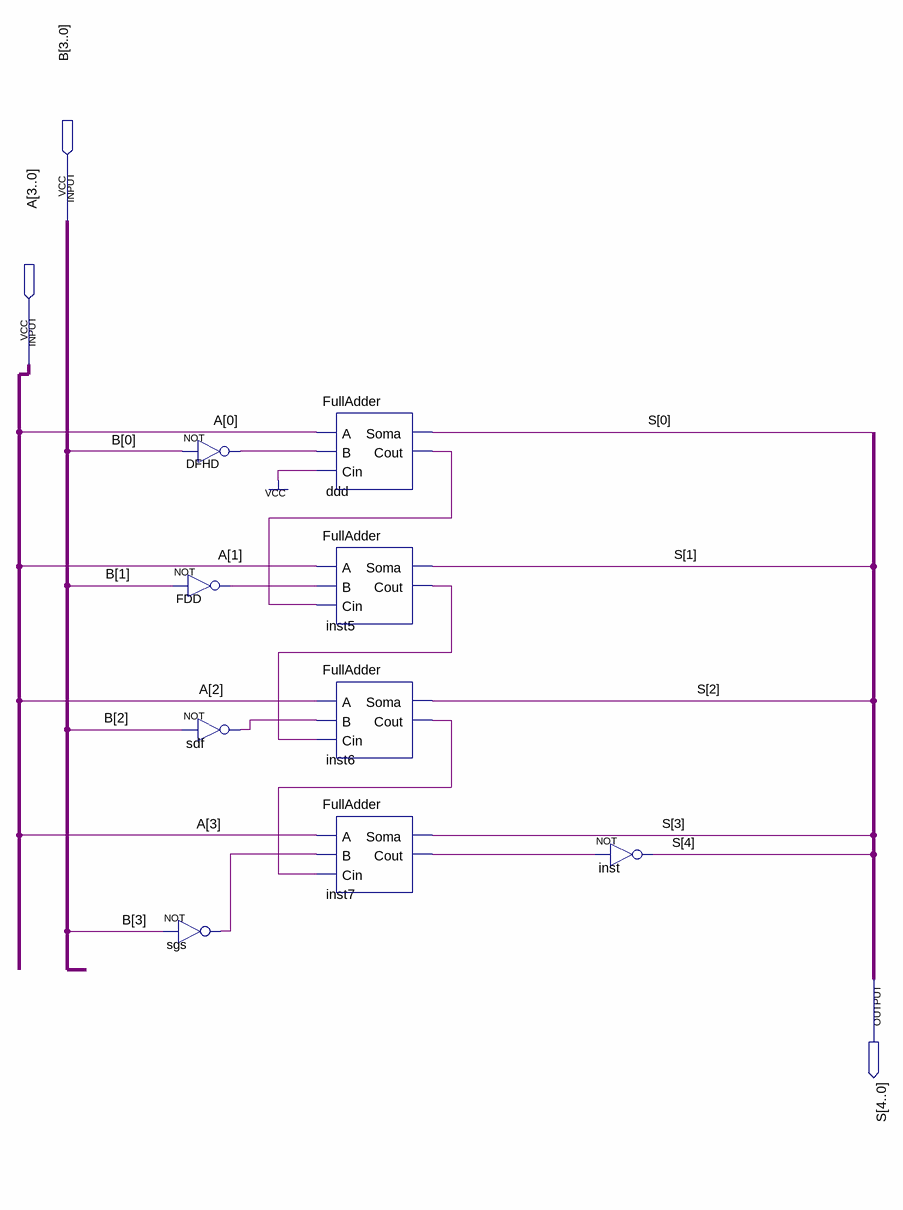
[diagram p0: schematic sheet]
// Quartus schematic sub4bits.bdf as structural Verilog: 9 symbols, 3 pins
module sub4bits (
  input  [3:0] B,
  input  [3:0] A,
  output [4:0] S
);

  wire ddd_cout, DFHD_out, FDD_out, inst5_cout, inst6_cout, inst7_cout, sdf_out, sgs_out;

  not FDD (FDD_out, B[1]);
  not sgs (sgs_out, B[3]);
  not DFHD (DFHD_out, B[0]);
  not sdf (sdf_out, B[2]);
  FullAdder ddd (.A(A[0]), .B(DFHD_out), .Cin(1'b1), .Soma(S[0]), .Cout(ddd_cout));
  FullAdder inst5 (.A(A[1]), .B(FDD_out), .Cin(ddd_cout), .Soma(S[1]), .Cout(inst5_cout));
  FullAdder inst6 (.A(A[2]), .B(sdf_out), .Cin(inst5_cout), .Soma(S[2]), .Cout(inst6_cout));
  FullAdder inst7 (.A(A[3]), .B(sgs_out), .Cin(inst6_cout), .Soma(S[3]), .Cout(inst7_cout));
  not inst (S[4], inst7_cout);
endmodule
